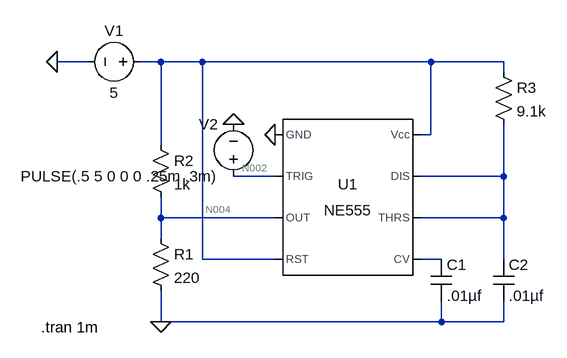
[diagram p0: schematic monostableclock.asc]
monostableclock.asc, the LTspice schematic file:
Version 4
SHEET 1 880 680
WIRE -176 -48 -224 -48
WIRE -64 -48 -96 -48
WIRE 0 -48 -64 -48
WIRE 352 -48 0 -48
WIRE 464 -48 352 -48
WIRE 464 -32 464 -48
WIRE 352 64 352 -48
WIRE 352 64 336 64
WIRE -64 80 -64 -48
WIRE 112 128 48 128
WIRE 464 128 464 48
WIRE 464 128 336 128
WIRE -64 192 -64 160
WIRE 112 192 -64 192
WIRE 464 192 464 128
WIRE 464 192 336 192
WIRE -64 224 -64 192
WIRE 0 256 0 -48
WIRE 112 256 0 256
WIRE 368 256 336 256
WIRE 464 256 464 192
WIRE -64 352 -64 304
WIRE 368 352 368 320
WIRE 368 352 -64 352
WIRE 464 352 464 320
WIRE 464 352 368 352
FLAG 112 64 0
FLAG -224 -48 0
FLAG -64 352 0
FLAG 48 48 0
SYMBOL Misc\\NE555 224 160 R0
SYMATTR InstName U1
SYMBOL cap 352 256 R0
SYMATTR InstName C1
SYMATTR Value .01µf
SYMBOL res -80 208 R0
SYMATTR InstName R1
SYMATTR Value 220
SYMBOL res -80 64 R0
SYMATTR InstName R2
SYMATTR Value 1k
SYMBOL res 448 -48 R0
SYMATTR InstName R3
SYMATTR Value 9.1k
SYMBOL cap 448 256 R0
SYMATTR InstName C2
SYMATTR Value .01µf
SYMBOL voltage -80 -48 R90
WINDOW 0 -32 56 VBottom 2
WINDOW 3 32 56 VTop 2
WINDOW 123 0 0 Left 2
WINDOW 39 0 0 Left 2
SYMATTR InstName V1
SYMATTR Value 5
SYMBOL voltage 48 144 R180
WINDOW 0 24 96 Left 2
WINDOW 3 24 16 Left 2
WINDOW 123 0 0 Left 2
WINDOW 39 0 0 Left 2
SYMATTR InstName V2
SYMATTR Value PULSE(.5 5 0 0 0 .25m .3m)
TEXT -248 360 Left 2 !.tran 1m

The netlist it stands for:
* monostableclock.asc
XU1 0 N002 N004 N001 N005 N003 N003 N001 NE555  ; pins GND TRIG OUT RST CV THRS DIS Vcc
C1 N005 0 .01µf
R1 N004 0 220
R2 N001 N004 1k
R3 N001 N003 9.1k
C2 N003 0 .01µf
V1 N001 0 5
V2 N002 0 PULSE(.5 5 0 0 0 .25m .3m)
.tran 1m
.lib NE555.sub
.backanno
.end

* Results of the author's LTspice run, read from the files saved beside the schematic
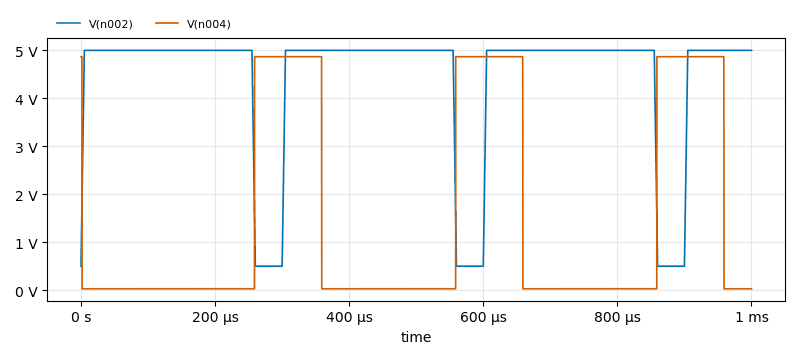
[diagram p1: Transient Analysis of monostableclock.asc, plotted from the saved traces]
* Transient Analysis, 1 run:
*   V(n002): min 500 mV, max 5 V, average 4.381 V, rms 4.643 V, last 5 V
*   V(n004): min 29.06 mV, max 4.868 V, average 1.488 V, rms 2.672 V, last 29.06 mV